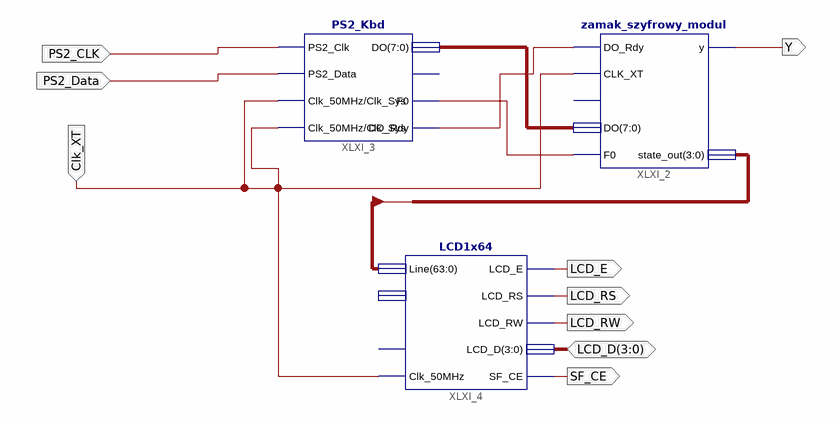
[diagram p0: schematic sheet 1]
// Xilinx ISE schematic sch.sch (spartan3e) as structural Verilog: 3 symbols, 9 ports
module sch (
  input  Clk_XT,
  input  PS2_CLK,
  input  PS2_Data,
  inout  [3:0] LCD_D,
  output Y,
  output LCD_E,
  output LCD_RS,
  output LCD_RW,
  output SF_CE
);

  wire XLXN_6, XLXN_15;
  wire [7:0] XLXN_7;
  wire [63:0] Line;

  zamak_szyfrowy_modul XLXI_2 (
    .DO_Rdy(XLXN_6), .F0(XLXN_15), .CLK_XT(Clk_XT), .DO(XLXN_7), .y(Y), .state_out(Line[3:0]));  // open: RST
  PS2_Kbd XLXI_3 (
    .PS2_Clk(PS2_CLK), .PS2_Data(PS2_Data), .Clk_50MHz(Clk_XT), .F0(XLXN_15), .DO_Rdy(XLXN_6), .DO(XLXN_7),
    .Clk_Sys(Clk_XT));  // open: E0
  LCD1x64 XLXI_4 (
    .Clk_50MHz(Clk_XT), .Line(Line), .LCD_D(LCD_D), .LCD_E(LCD_E), .LCD_RW(LCD_RW), .LCD_RS(LCD_RS),
    .SF_CE(SF_CE));  // open: Reset, Blank
endmodule
